# EAGLE schematic schematic1 (EAGLE 9.1.1)
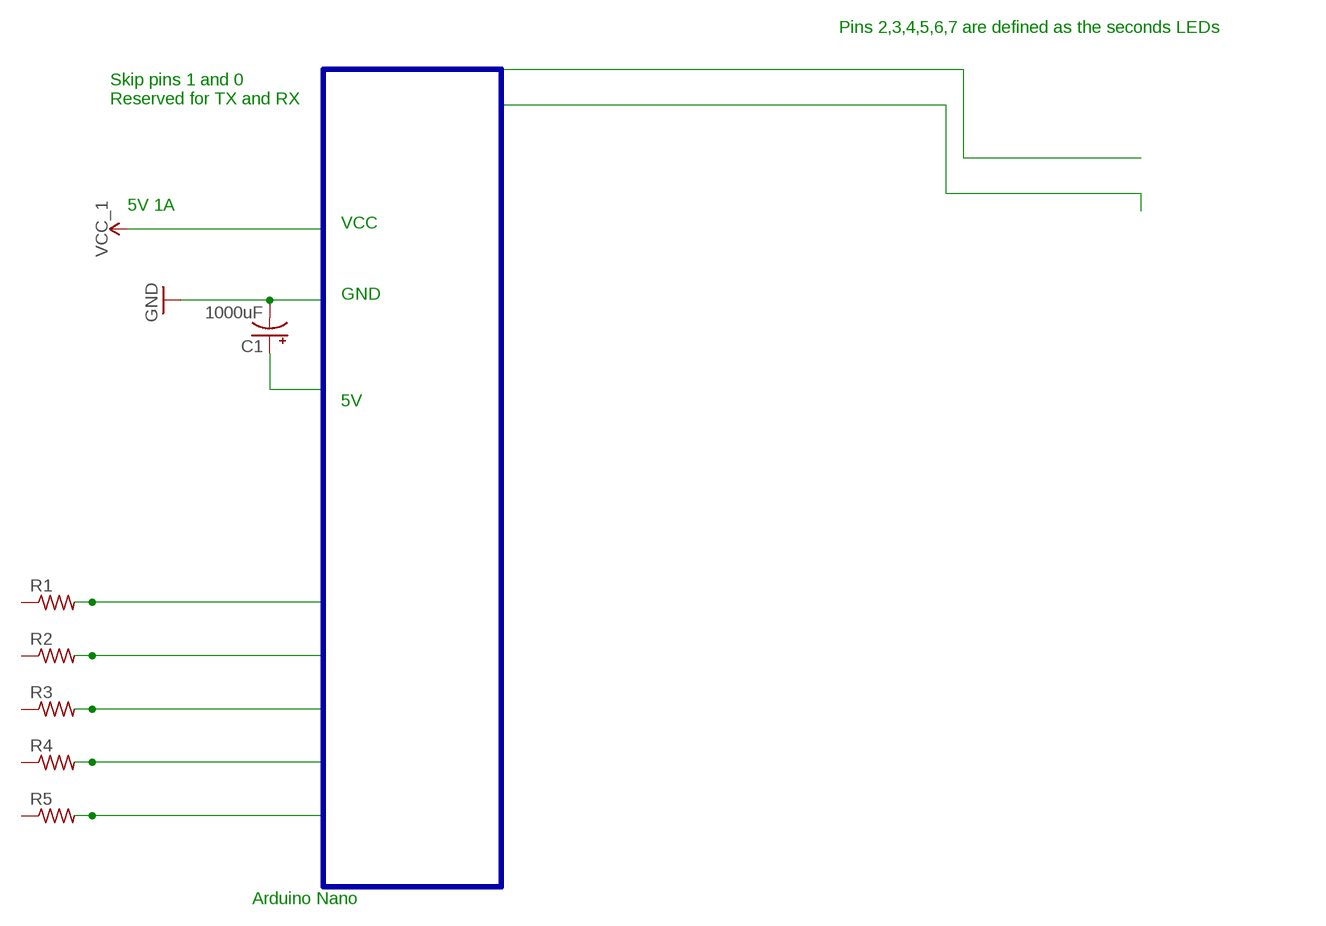
[diagram p0: schematic, sheet 1]

## Parts
C1  1000uF  1000UF-RADIAL-5MM-25V-20%  [CPOL-RADIAL-5MM-10MM]
R1  R-US_0204/2V  [0204V]
R2  R-US_0204/2V  [0204V]
R3  R-US_0204/2V  [0204V]
R4  R-US_0204/2V  [0204V]
R5  R-US_0204/2V  [0204V]

## Nets
GND: C1.-
N$3: C1.+
N$4: R1.2
N$5: R2.2
N$6: R3.2
N$7: R4.2
N$8: R5.2
Unconnected: R1.1 R2.1 R3.1 R4.1 R5.1

## Buses
B$1

## Notes on the sheet
- Pins 2,3,4,5,6,7 are defined as the seconds LEDs
- Skip pins 1 and 0
  Reserved for TX and RX
- 5V 1A
- VCC
- GND
- 5V
- Arduino Nano

## Library data of the parts
C1 = SparkFun-Capacitors:1000UF: 1,000µF/1mF ceramic capacitors A capacitor is a passive two-terminal electrical component used to store electrical energy temporarily in an electric field. CAP-08070; PROD_ID: CAP-09538; VALUE: 1mF
R1-R5 = rcl:R-US_: RESISTOR, American symbol; SPICEPREFIX: R

## Module ARDUINONANO
Ports: 

### Library data of the parts